# Altium schematic sheet FMC_connector.SchDoc
size A
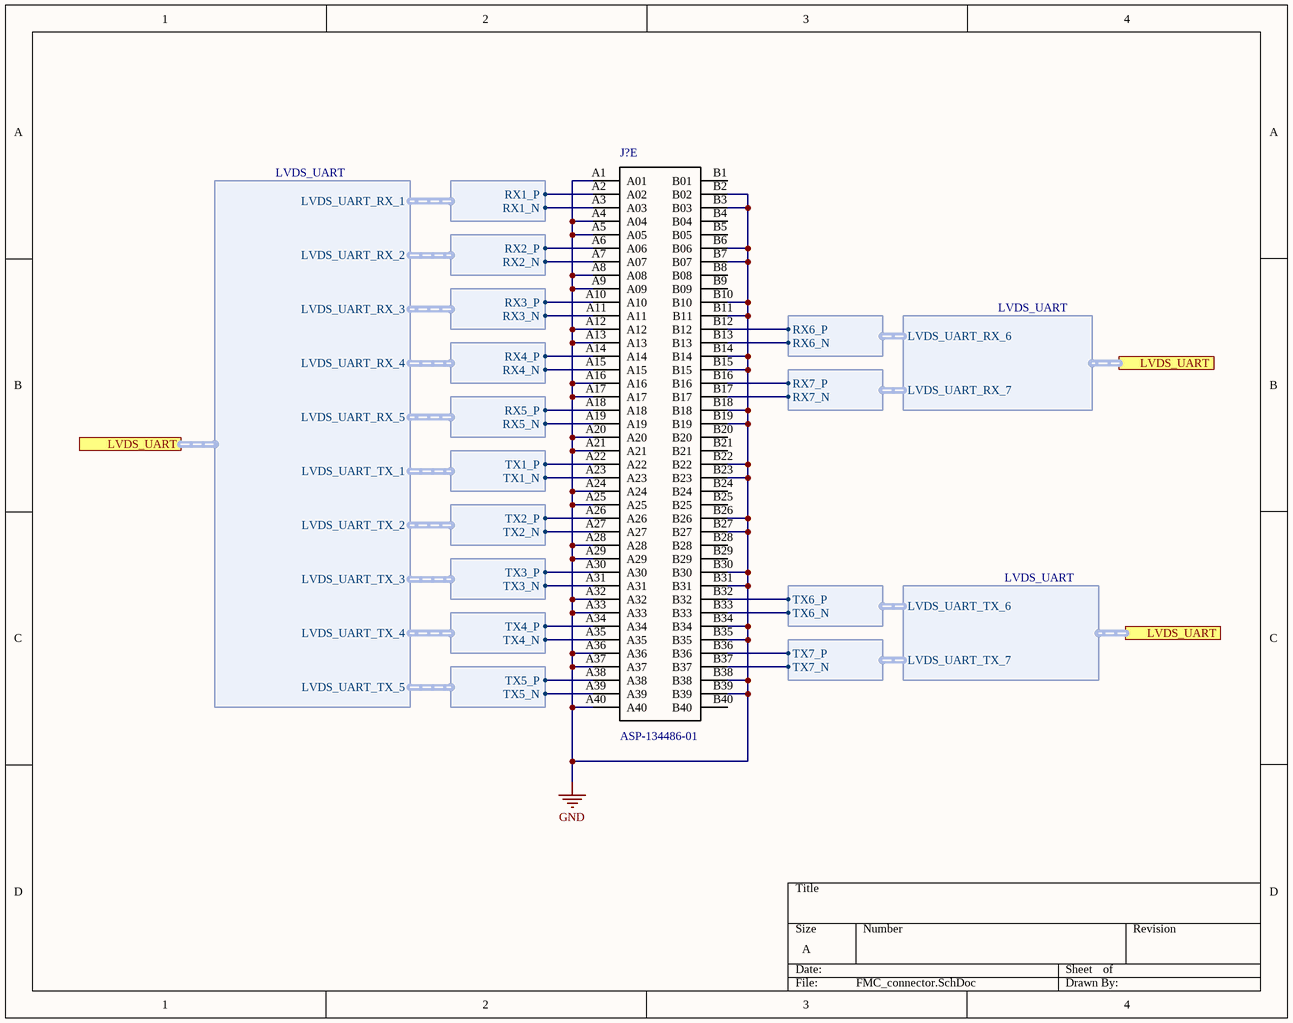
[diagram p0: FMC_connector.SchDoc]

## Parts
J?  ASP-134486-01  [*SAMTEC_ASP-134486-01_ASP-134486-01(Primary)]  (part E of 5)

## Ports
LVDS_UART (harness LVDS_UART)

## Harnesses
LVDS_UART_RX_1: RX1_P, RX1_N
LVDS_UART_RX_2: RX2_P, RX2_N
LVDS_UART_RX_3: RX3_P, RX3_N
LVDS_UART_RX_4: RX4_P, RX4_N
LVDS_UART_RX_5: RX5_P, RX5_N
LVDS_UART_RX_6: RX6_P, RX6_N
LVDS_UART_RX_7: RX7_P, RX7_N
LVDS_UART_TX_1: TX1_P, TX1_N
LVDS_UART_TX_2: TX2_P, TX2_N
LVDS_UART_TX_3: TX3_P, TX3_N
LVDS_UART_TX_4: TX4_P, TX4_N
LVDS_UART_TX_5: TX5_P, TX5_N
LVDS_UART_TX_6: TX6_P, TX6_N
LVDS_UART_TX_7: TX7_P, TX7_N
LVDS_UART: LVDS_UART_RX_1, LVDS_UART_RX_2, LVDS_UART_RX_3, LVDS_UART_RX_4, LVDS_UART_RX_5, LVDS_UART_TX_1, LVDS_UART_TX_2, LVDS_UART_TX_3, LVDS_UART_TX_4, LVDS_UART_TX_5
LVDS_UART: LVDS_UART_RX_6, LVDS_UART_RX_7
LVDS_UART: LVDS_UART_TX_6, LVDS_UART_TX_7

## Nets
GND: J?.A1(A01) J?.A4(A04) J?.A5(A05) J?.A8(A08) J?.A9(A09) J?.A12 J?.A13 J?.A16 J?.A17 J?.A20 J?.A21 J?.A24 J?.A25 J?.A28 J?.A29 J?.A32 J?.A33 J?.A36 J?.A37 J?.A40 J?.B2(B02) J?.B3(B03) J?.B6(B06) J?.B7(B07) J?.B10 J?.B11 J?.B14 J?.B15 J?.B18 J?.B19 J?.B22 J?.B23 J?.B26 J?.B27 J?.B30 J?.B31 J?.B34 J?.B35 J?.B38 J?.B39
NetJ?_A2: J?.A2(A02) ; harness LVDS_UART_RX_1.RX1_P
NetJ?_A3: J?.A3(A03) ; harness LVDS_UART_RX_1.RX1_N
NetJ?_A6: J?.A6(A06) ; harness LVDS_UART_RX_2.RX2_P
NetJ?_A7: J?.A7(A07) ; harness LVDS_UART_RX_2.RX2_N
NetJ?_A10: J?.A10 ; harness LVDS_UART_RX_3.RX3_P
NetJ?_A11: J?.A11 ; harness LVDS_UART_RX_3.RX3_N
NetJ?_A14: J?.A14 ; harness LVDS_UART_RX_4.RX4_P
NetJ?_A15: J?.A15 ; harness LVDS_UART_RX_4.RX4_N
NetJ?_A18: J?.A18 ; harness LVDS_UART_RX_5.RX5_P
NetJ?_A19: J?.A19 ; harness LVDS_UART_RX_5.RX5_N
NetJ?_A22: J?.A22 ; harness LVDS_UART_TX_1.TX1_P
NetJ?_A23: J?.A23 ; harness LVDS_UART_TX_1.TX1_N
NetJ?_A26: J?.A26 ; harness LVDS_UART_TX_2.TX2_P
NetJ?_A27: J?.A27 ; harness LVDS_UART_TX_2.TX2_N
NetJ?_A30: J?.A30 ; harness LVDS_UART_TX_3.TX3_P
NetJ?_A31: J?.A31 ; harness LVDS_UART_TX_3.TX3_N
NetJ?_A34: J?.A34 ; harness LVDS_UART_TX_4.TX4_P
NetJ?_A35: J?.A35 ; harness LVDS_UART_TX_4.TX4_N
NetJ?_A38: J?.A38 ; harness LVDS_UART_TX_5.TX5_P
NetJ?_A39: J?.A39 ; harness LVDS_UART_TX_5.TX5_N
NetJ?_B12: J?.B12 ; harness LVDS_UART_RX_6.RX6_P
NetJ?_B13: J?.B13 ; harness LVDS_UART_RX_6.RX6_N
NetJ?_B16: J?.B16 ; harness LVDS_UART_RX_7.RX7_P
NetJ?_B17: J?.B17 ; harness LVDS_UART_RX_7.RX7_N
NetJ?_B32: J?.B32 ; harness LVDS_UART_TX_6.TX6_P
NetJ?_B33: J?.B33 ; harness LVDS_UART_TX_6.TX6_N
NetJ?_B36: J?.B36 ; harness LVDS_UART_TX_7.TX7_P
NetJ?_B37: J?.B37 ; harness LVDS_UART_TX_7.TX7_N

Not connected (* = marked no-connect by the designer): J? B1(B01) B4(B04) B5(B05) B8(B08) B9(B09) B20 B21 B24 B25 B28 B29 B40

## Library data of the parts
J? = ASP-134486-01: 400 Position Connector Array, Female Sockets Surface Mount Gold; MF: Samtec Inc.; MP: ASP-134486-01; Digi-Key_Purchase_URL: https://www.digikey.com/product-detail/en/samtec-inc/ASP-134486-01/SAM8728CT-ND/2135095?utm_source=snapeda&utm_medium=aggregator&utm_campaign=symbol; SnapEDA_Link: https://www.snapeda.com/parts/ASP-134486-01/Samtec%20Inc./view-part/898249/?ref=snap; Package: None; Digi-Key_Part_Number: SAM8728CT-ND; Value: *